# EAGLE design shield (EAGLE 9.6.2)
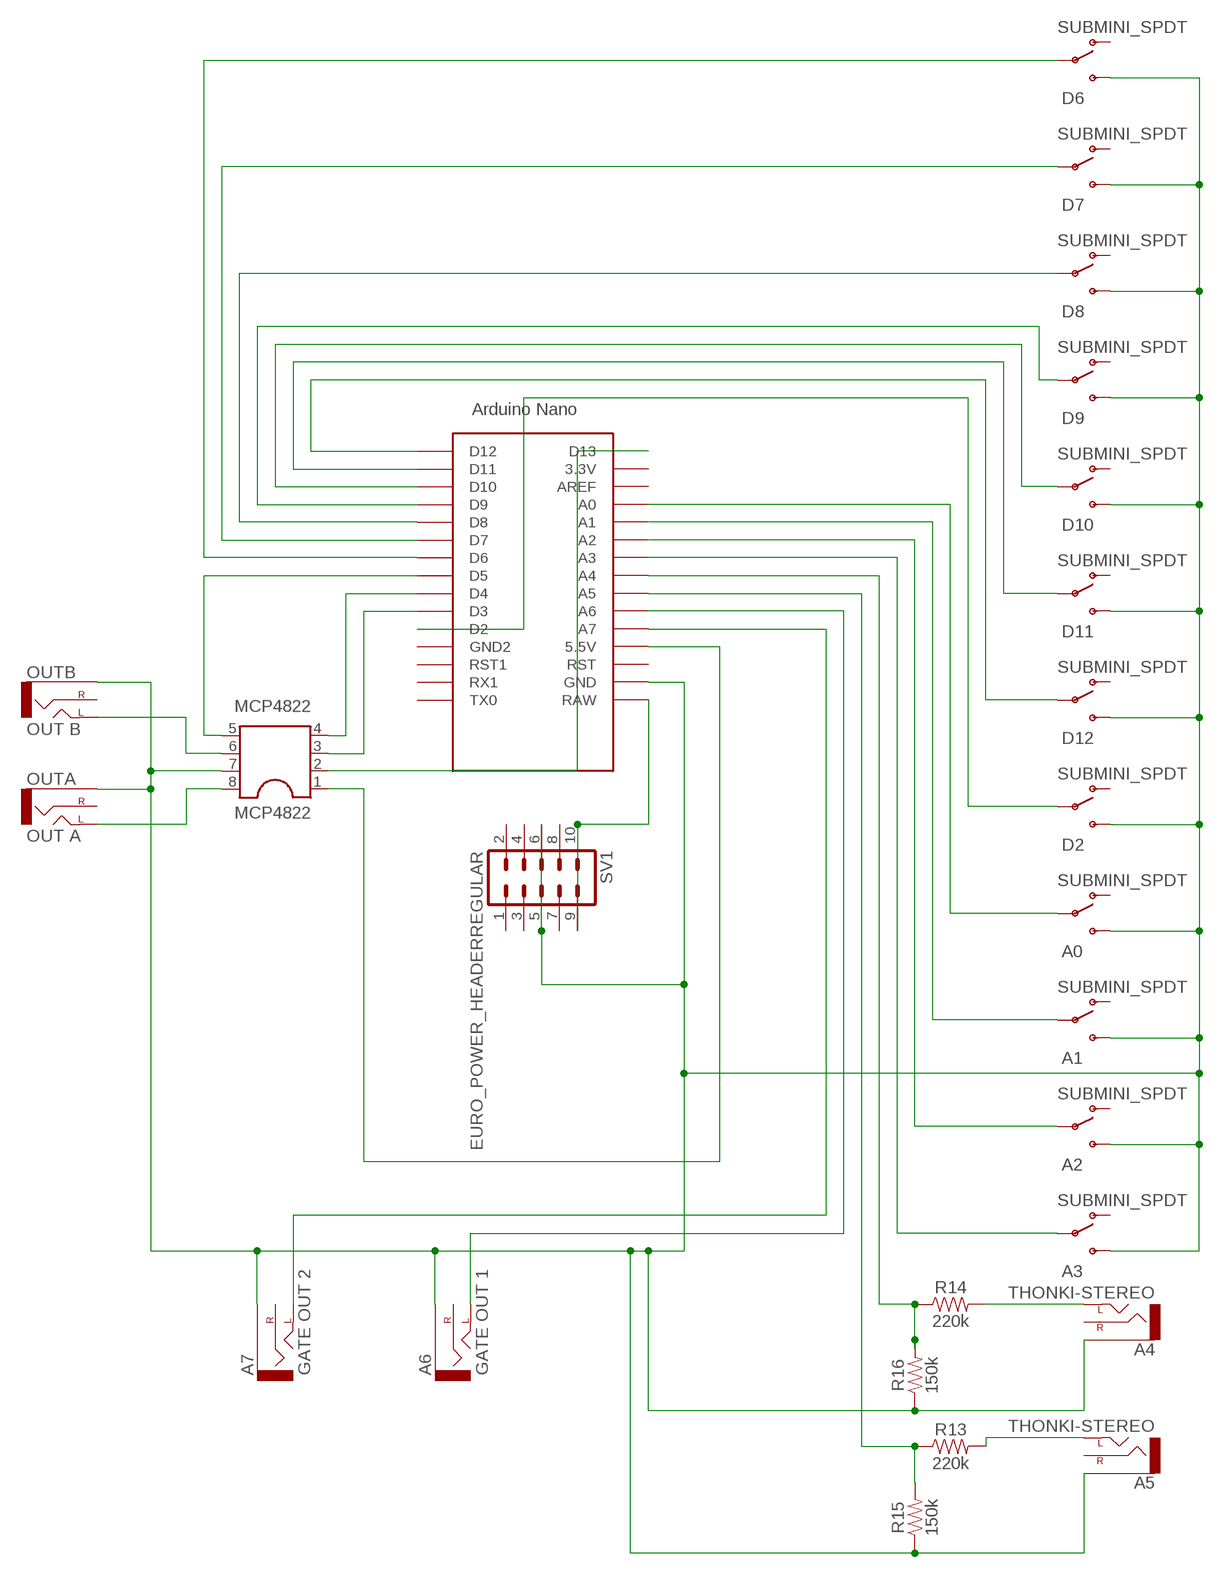
[diagram p0: schematic, sheet 1]

## Parts
A0  SUBMINI_SPDT  [SUBMINI_TOGGLE]
A1  SUBMINI_SPDT  [SUBMINI_TOGGLE]
A2  SUBMINI_SPDT  [SUBMINI_TOGGLE]
A3  SUBMINI_SPDT  [SUBMINI_TOGGLE]
A4  THONKI-STEREO  [WQP-PJ366ST_JACK]
A5  THONKI-STEREO  [WQP-PJ366ST_JACK]
A6  GATE OUT 1  THONKI-STEREO  [WQP-PJ366ST_JACK]
A7  GATE OUT 2  THONKI-STEREO  [WQP-PJ366ST_JACK]
D2  SUBMINI_SPDT  [SUBMINI_TOGGLE]
D6  SUBMINI_SPDT  [SUBMINI_TOGGLE]
D7  SUBMINI_SPDT  [SUBMINI_TOGGLE]
D8  SUBMINI_SPDT  [SUBMINI_TOGGLE]
D9  SUBMINI_SPDT  [SUBMINI_TOGGLE]
D10  SUBMINI_SPDT  [SUBMINI_TOGGLE]
D11  SUBMINI_SPDT  [SUBMINI_TOGGLE]
D12  SUBMINI_SPDT  [SUBMINI_TOGGLE]
MCP4822  MCP4822  DIL8  [DIL08]
OUTA  OUT A  THONKI-STEREO  [WQP-PJ366ST_JACK]
OUTB  OUT B  THONKI-STEREO  [WQP-PJ366ST_JACK]
R13  220k  10KOHM-HORIZ-1/4W-5%  [AXIAL-0.3]
R14  220k  10KOHM-HORIZ-1/4W-5%  [AXIAL-0.3]
R15  150k  10KOHM-HORIZ-1/4W-5%  [AXIAL-0.3]
R16  150k  10KOHM-HORIZ-1/4W-5%  [AXIAL-0.3]
SV1  EURO_POWER_HEADERREGULAR  [EURO_POWER_HEADER]
U$1  NANO  [NANO]

## Nets
N$1: SV1.9 SV1.10 U$1.RAW
N$2: A6.P$1_TIP(LEFT) U$1.A6
N$3: MCP4822.1 U$1.5V(5.5V)
N$4: D6.COM(COMMON) U$1.D6
N$5: D7.COM(COMMON) U$1.D7
N$6: A7.P$1_TIP(LEFT) U$1.A7
N$7: D9.COM(COMMON) U$1.D9
N$8: D10.COM(COMMON) U$1.D10
N$9: D11.COM(COMMON) U$1.D11
N$10: D12.COM(COMMON) U$1.D12
N$11: D2.COM(COMMON) U$1.D2
N$12: A0.COM(COMMON) U$1.A0
N$13: A1.COM(COMMON) U$1.A1
N$14: A2.COM(COMMON) U$1.A2
N$15: A3.COM(COMMON) U$1.A3
N$17: MCP4822.8 OUTA.P$1_TIP(LEFT)
N$18: MCP4822.6 OUTB.P$1_TIP(LEFT)
N$19: MCP4822.2 U$1.D13
N$20: MCP4822.3 U$1.D3
N$21: MCP4822.4 U$1.D4
N$22: MCP4822.5 U$1.D5
N$23: A0.3(S) A1.3(S) A2.3(S) A3.3(S) A4.P$3_SLEEVE(SLEEVE) A5.P$3_SLEEVE(SLEEVE) A6.P$3_SLEEVE(SLEEVE) A7.P$3_SLEEVE(SLEEVE) D2.3(S) D6.3(S) D7.3(S) D8.3(S) D9.3(S) D10.3(S) D11.3(S) D12.3(S) MCP4822.7 OUTA.P$3_SLEEVE(SLEEVE) OUTB.P$3_SLEEVE(SLEEVE) R15.P$1 R16.P$1 SV1.5 SV1.6 U$1.GND
N$24: D8.COM(COMMON) U$1.D8
N$25: A5.P$1_TIP(LEFT) R13.P$2
N$26: A4.P$1_TIP(LEFT) R14.P$2
N$29: R14.P$1 R16.P$2 U$1.A4
N$30: R13.P$1 R15.P$2 U$1.A5
Unconnected: A0.1(O) A1.1(O) A2.1(O) A3.1(O) A4.P$2_SWITCH(RIGHT) A5.P$2_SWITCH(RIGHT) A6.P$2_SWITCH(RIGHT) A7.P$2_SWITCH(RIGHT) D2.1(O) D6.1(O) D7.1(O) D8.1(O) D9.1(O) D10.1(O) D11.1(O) D12.1(O) OUTA.P$2_SWITCH(RIGHT) OUTB.P$2_SWITCH(RIGHT) SV1.1 SV1.2 SV1.3 SV1.4 SV1.7 SV1.8 U$1.3.3V U$1.AREF U$1.GND1(GND2) U$1.ICSP1 U$1.ICSP2 U$1.ICSP3 U$1.ICSP4 U$1.ICSP5 U$1.ICSP6 U$1.RST U$1.RST1 U$1.RX1 U$1.TX0

## Library data of the parts
A0 A1-A3 D2 D6-D12 = MusicThingModular:SUBMINI_SPDT
A4-A7 OUTA OUTB = MusicThingModular:THONKI-STEREO: 3.5mm socket for Eurorack modular synths
MCP4822 = ic-package:DIL8: Dual In Line / Socket
R13-R16 = SparkFun-Resistors:10KOHM: 10kΩ resistor A resistor is a passive two-terminal electrical component that implements electrical resistance as a circuit element. Resistors act to reduce current flow, and, at the same time, act to lower voltage levels within circuits. - Wikipedia; PROD_ID: RES-09435; VALUE: 10k
SV1 = MusicThingModular:EURO_POWER_HEADER: Power Header 10 pin power header for Eurorack Power Supplies Variants with fatter pads for easier soldering, and the LOCK variant which has 5mil offset pins to hold the component in place before soldering
U$1 = Arduino-clone:NANO: Arduino Nano

## Board
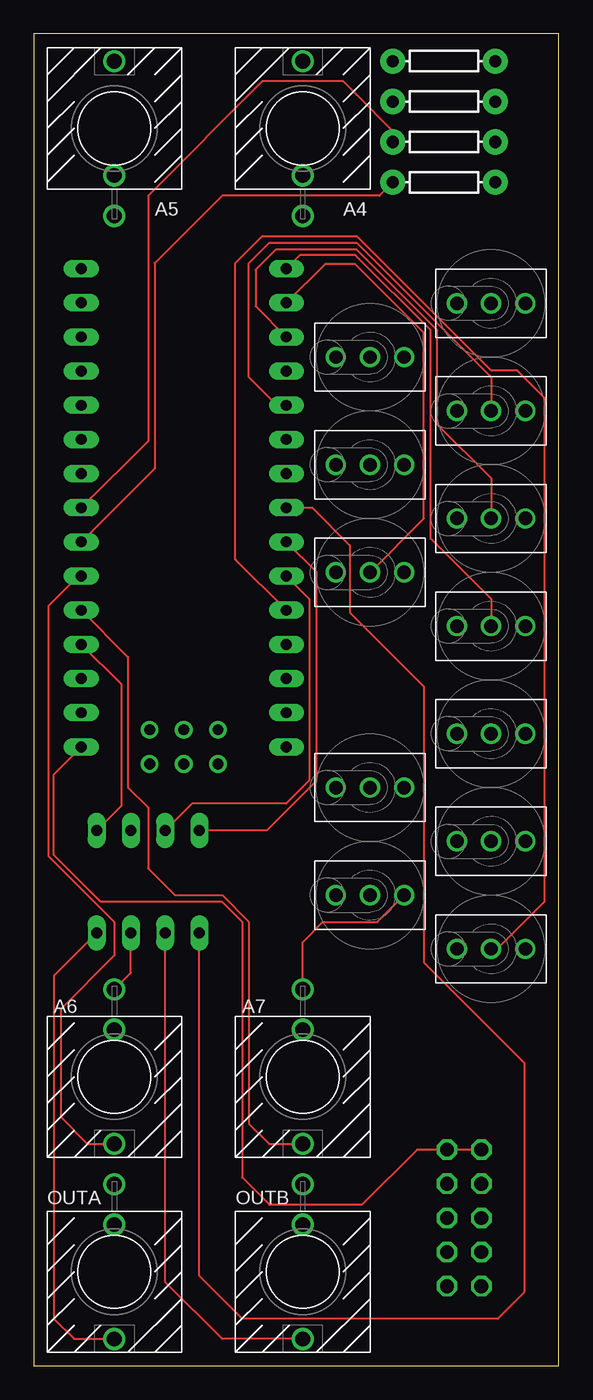
[diagram p1: board, top side]
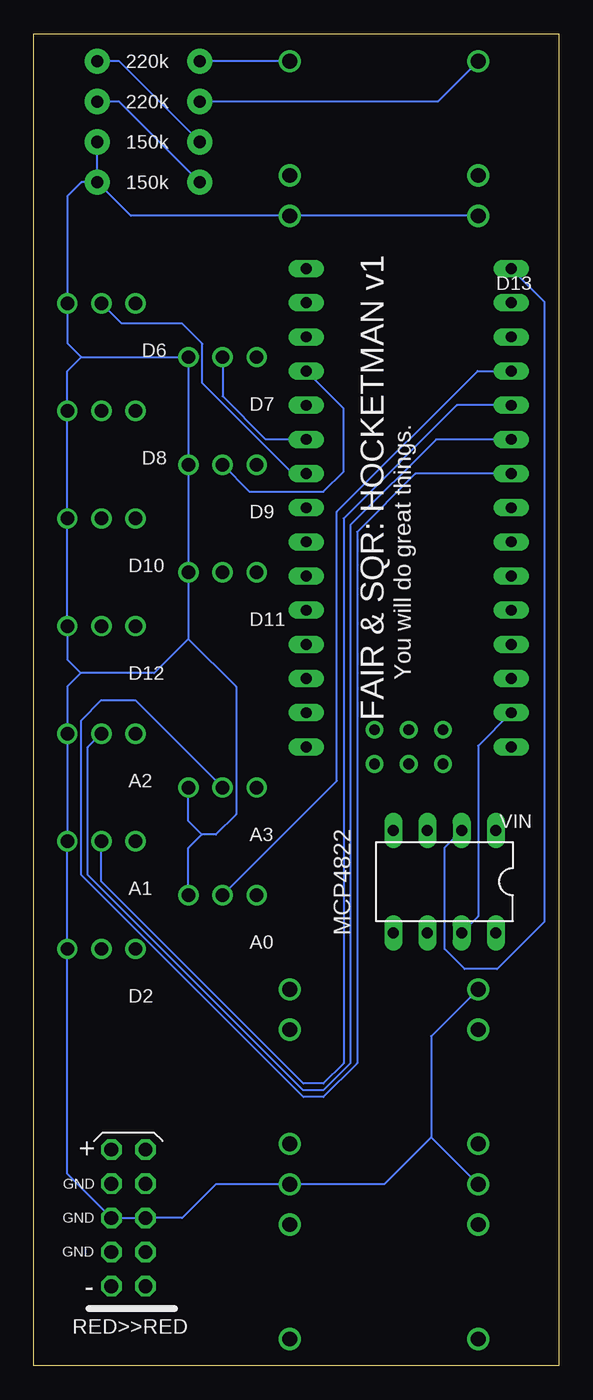
[diagram p2: board, bottom side, seen from below]

Size 39.04 x 99.05 mm. Coordinates in mm from the lower left corner, seen from the top.
Outline: 0,0 39.04,0 39.04,99.05 0,99.05 0,0
Copper layers (1*16): Top 0.035mm / dielectric 1.5mm / Bottom 0.035mm
Design rules "default": minimum track width 6mil, minimum drill 0.35mm, track to track 6mil, track to pad 6mil, pad to pad 6mil, via to via 6mil, smd to smd 6mil, copper to edge 40mil, drill to drill 6mil, minimum pad ring 10mil, minimum via ring 8mil, stop-mask expansion 4mil, vias tented up to drill 0mil, thermal gap 10mil

### Footprints (pad centres in the part's own frame; a part is rotated, then mirrored left to right if it is on the bottom)
SUBMINI_TOGGLE = drill 1 pad 1.422: 1 -2.54,0; 3 2.54,0; COM 0,0
WQP-PJ366ST_JACK = drill 1.1: P$1_TIP 0,5; P$2_SWITCH 0,-3.5; P$3_SLEEVE 0,-6.5
DIL08 = drill 0.813 long: 1 -3.81,-3.81; 2 -1.27,-3.81; 3 1.27,-3.81; 4 3.81,-3.81; 5 3.81,3.81; 6 1.27,3.81; 7 -1.27,3.81; 8 -3.81,3.81
AXIAL-0.3 = drill 0.9 pad 1.88: P$1 -3.81,0; P$2 3.81,0
EURO_POWER_HEADER = drill 1.016 octagon: 1 -5.08,-1.27; 2 -5.08,1.27; 3 -2.54,-1.27; 4 -2.54,1.27; 5 0,-1.27; 6 0,1.27; 7 2.54,-1.27; 8 2.54,1.27; 9 5.08,-1.27; 10 5.08,1.27
NANO = drill 0.8 long: 3.3V -10.16,24.13; 5V -10.16,-1.27; A0 -10.16,19.05; A1 -10.16,16.51; A2 -10.16,13.97; A3 -10.16,11.43; A4 -10.16,8.89; A5 -10.16,6.35; A6 -10.16,3.81; A7 -10.16,1.27; AREF -10.16,21.59; D2 5.08,1.27; D3 5.08,3.81; D4 5.08,6.35; D5 5.08,8.89; D6 5.08,11.43; D7 5.08,13.97; D8 5.08,16.51; D9 5.08,19.05; D10 5.08,21.59; D11 5.08,24.13; D12 5.08,26.67; D13 -10.16,26.67; GND -10.16,-6.35; GND1 5.08,-1.27; RAW -10.16,-8.89; RST -10.16,-3.81; RST1 5.08,-3.81; RX1 5.08,-6.35; TX0 5.08,-8.89 | drill 0.8: ICSP1 -5.08,-10.16; ICSP2 -5.08,-7.62; ICSP3 -2.54,-10.16; ICSP4 -2.54,-7.62; ICSP5 0,-10.16; ICSP6 0,-7.62

### Placement (x,y rotation side)
A0  25,35 0 top
A1  34,39 0 top
A2  34,47 0 top
A3  25,43 0 top
A4  20,92 0 top
A5  6,92 0 top
A6  6,21.5 180 top
A7  20,21.5 180 top
D2  34,31 0 top
D6  34,79 0 top
D7  25,75 0 top
D8  34,71 0 top
D9  25,67 0 top
D10  34,63 0 top
D11  25,59 0 top
D12  34,55 0 top
MCP4822  8.5,36 180 bottom
OUTA  6,7 180 top
OUTB  20,7 180 top
R13  30.5,94 180 top
R14  30.5,97 180 top
R15  30.5,88 180 top
R16  30.5,91 180 top
SV1  32,11 90 bottom
U$1  13.7,54.91 0 top

### Tracks (layer width: path | path; a pad name or v marks a point on that pad's centre or on a via)
N$1
  Top 0.152: SV1.10 SV1.9 28.5,16.08 24.42,12 17.5,12 15.5,14 15.5,33 14,34.5 5,34.5 1.5,38 1.5,43.98 U$1.RAW
N$2
  Top 0.152: U$1.A6 3.31,58.72 1.09,56.5 1.09,37.91 6,33 6,30.5 2,26.5 2,18.5 4,16.5 A6.P$1_TIP
N$3
  Top 0.152: MCP4822.1 6.5,41.62 6.5,50.68 U$1.5V
N$4
  Bottom 0.152: D6.COM 32.5,77.5 28,77.5 26.5,76 26.5,73.06 19.78,66.34 U$1.D6
N$5
  Bottom 0.152: U$1.D7 21.78,68.88 25,72.1 D7.COM
N$6
  Top 0.152: U$1.A7 7,52.72 7,43 8.5,41.5 8.5,37 10.5,35 14,35 16,33 16,18 17.5,16.5 A7.P$1_TIP
N$7
  Bottom 0.152: D9.COM 23,65 17.5,65 16,66.5 16,71.18 U$1.D9
N$8
  Top 0.152: D10.COM 34,66 30,70 30,77 24,83 18,83 16.5,81.5 16.5,78.78 U$1.D10
N$9
  Top 0.152: D11.COM 29,63 29,76.82 23.9,81.92 21.66,81.92 U$1.D11
N$10
  Top 0.152: D12.COM 34,57 29.5,61.5 29.5,77 23.92,82.58 19.78,82.58 U$1.D12
N$11
  Top 0.152: U$1.D2 15,59.96 15,82 17,84 24,84 34,74 35.95,74 37.95,72 37.95,34.5 34.45,31 D2.COM
N$12
  Bottom 0.152: U$1.A0 6.04,73.96 16.5,63.5 16.5,43.5 A0.COM
N$13
  Bottom 0.152: U$1.A1 7.58,71.42 16,63 16,22.5 17.5,21 19,21 34,36 A1.COM
N$14
  Bottom 0.152: U$1.A2 9.12,68.88 15.5,62.5 15.5,22.5 17.5,20.5 19,20.5 35,36.5 35,46 A2.COM
N$15
  Bottom 0.152: U$1.A3 10.66,66.34 15,62 15,22.5 17.5,20 19,20 35.5,36.5 35.5,48 34,49.5 31.5,49.5 A3.COM
N$17
  Top 0.152: MCP4822.8 1.5,29 1.5,3.5 3,2 OUTA.P$1_TIP
N$18
  Top 0.152: OUTB.P$1_TIP 14,2 9.77,6.23 MCP4822.6
N$19
  Bottom 0.152: U$1.D13 1.09,79.13 1.09,33 4.59,29.5 7,29.5 8.5,31 8.5,38.54 MCP4822.2
N$20
  Top 0.152: MCP4822.3 11.77,41.81 18.77,41.81 20.5,43.54 20.5,57 U$1.D3
N$21
  Top 0.152: MCP4822.4 17.31,39.81 21,43.5 21,59.04 U$1.D4
N$22
  Top 0.152: MCP4822.5 12.31,6.69 15.5,3.5 34.5,3.5 36.5,5.5 36.5,22.5 29,30 29,50.5 23.5,56 23.5,61 20.7,63.8 U$1.D5
N$23
  Top 0.152: A6.P$3_SLEEVE 7.23,29.23 MCP4822.7 | A7.P$3_SLEEVE 20,31.5 21.5,33 25.54,33 A0.3
  Bottom 0.152: A0.3 27.54,38.5 26.54,39.5 | A3.3 27.54,40.5 26.54,39.5 | 35.5,75 36.54,76.04 D6.3 36.54,86.96 35.5,88 R15.P$1 | 35.5,75 D7.3 D9.3 D11.3 27.54,54.04 | 35.5,75 36.54,73.96 D8.3 D10.3 D12.3 36.54,52.5 35.54,51.5 | 27.54,54.04 24,50.5 24,41 25.5,39.5 26.54,39.5 | 27.54,54.04 30.08,51.5 35.54,51.5 | 35.54,51.5 36.54,50.5 A2.3 A1.3 D2.3 36.54,14.27 SV1.6 SV1.5 28,11 25.5,13.5 OUTB.P$3_SLEEVE 13,13.5 9.5,17 | A5.P$3_SLEEVE A4.P$3_SLEEVE 31.81,85.5 R15.P$1 | U$1.GND 6,46.1 6,33.42 MCP4822.7 | A6.P$3_SLEEVE 9.5,24.5 9.5,17 | OUTA.P$3_SLEEVE 9.5,17 | R15.P$1 R16.P$1
N$24
  Top 0.152: D8.COM 34,73.5 24,83.5 17.5,83.5 16,82 16,73.5 18.08,71.42 U$1.D8
N$25
  Bottom 0.152: A5.P$1_TIP 9,94 R13.P$2
N$26
  Bottom 0.152: A4.P$1_TIP R14.P$2
N$29
  Top 0.152: U$1.A4 8.5,68.76 8.5,87 17,95.5 23,95.5 24,94.5 26.69,91.81 R16.P$2
  Bottom 0.152: R16.P$2 32.69,97 R14.P$1
N$30
  Top 0.152: U$1.A5 9,66.72 9,82 14,87 25.69,87 R15.P$2
  Bottom 0.152: R15.P$2 32.69,94 R13.P$1

### Text on the board
bNames: 220k | 220k | 150k | 150k | D13 | You will do great things. | FAIR & SQR: HOCKETMAN v1 | VIN